# EAGLE design Matching Network V1p1 (EAGLE 9.6.2)
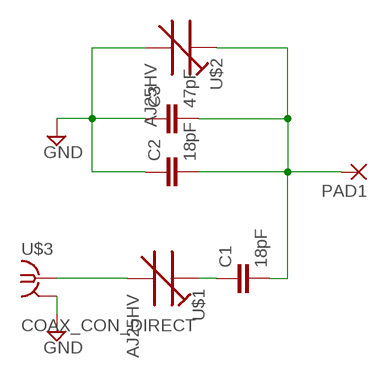
[diagram p0: schematic, sheet 1]

## Parts
C1  18pF  C-EUC1210  [C1210]
C2  18pF  C-EUC1210  [C1210]
C3  47pF  C-EUC1210  [C1210]
PAD1  SMD5  [SMD2,54-5,08]
U$1  AJ25HV  [AJ25HV]
U$2  AJ25HV  [AJ25HV]
U$3  COAX_CON_DIRECT  [COAX.141]

## Nets
GND: C2.1 C3.1 U$2.P$1(A) U$3.P$2(GND)
N$1: C1.1 U$1.P$2(E)
N$2: C1.2 C2.2 C3.2 PAD1.1(P) U$2.P$2(E)
N$3: U$1.P$1(A) U$3.P$1

## Library data of the parts
C1-C3 = rcl:C-EU: CAPACITOR, European symbol; SPICEPREFIX: C
PAD1 = wirepad:SMD5: SMD PAD
U$1 U$2 = Orzada:AJ25HV
U$3 = Orzada:COAX_CON_DIRECT: Direct Coax to Bord Top

## Board
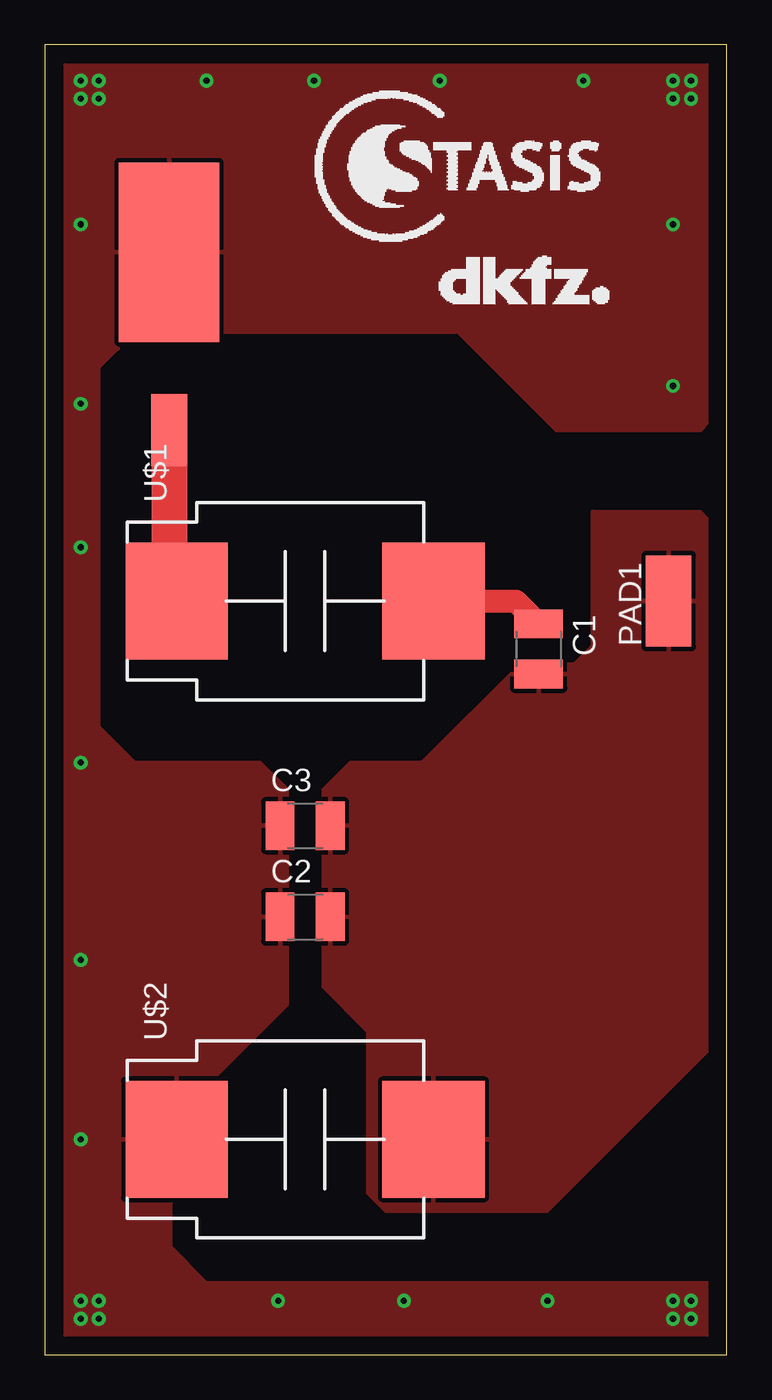
[diagram p1: board, top side]
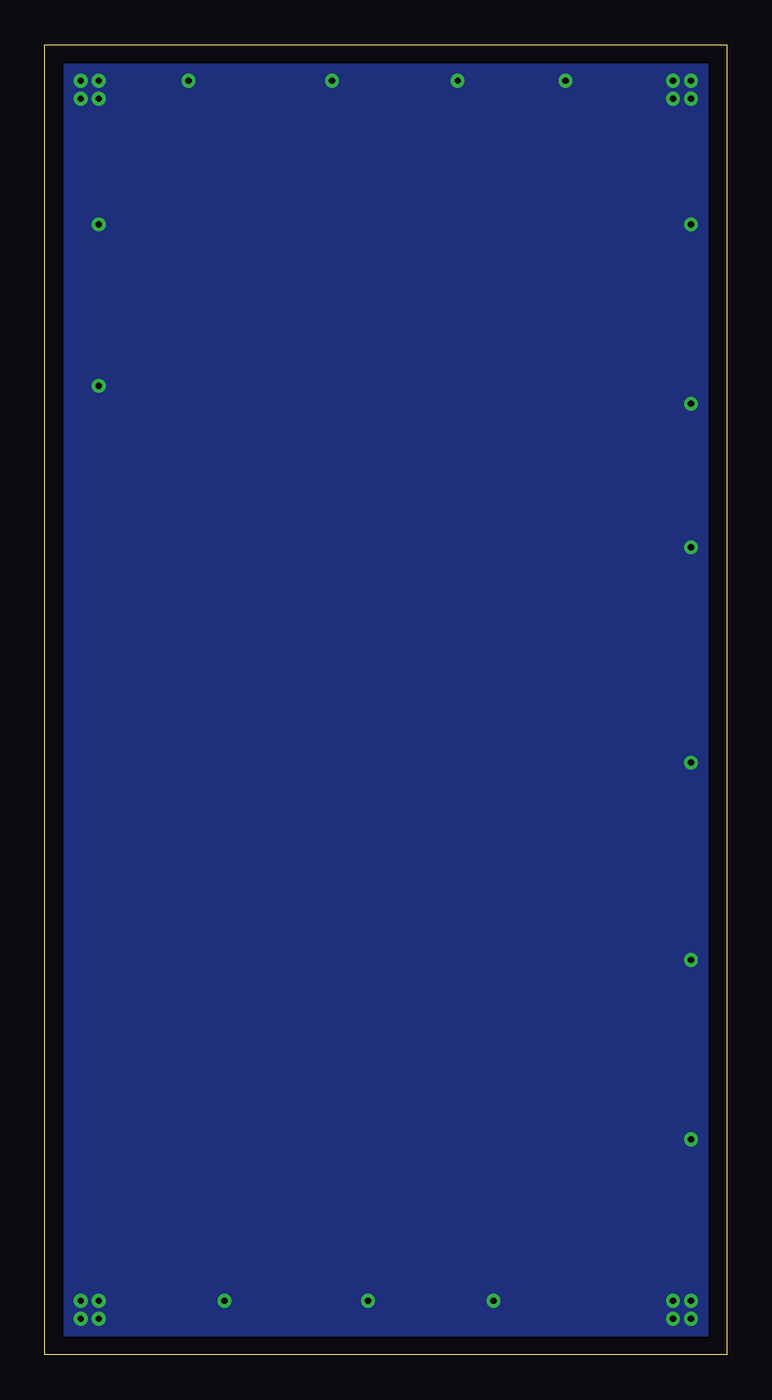
[diagram p2: board, bottom side, seen from below]

Size 38 x 73 mm. Coordinates in mm from the lower left corner, seen from the top.
Outline: 0,0 38,0 38,73 0,73 0,0
Copper layers (1*16): Top 0.035mm / dielectric 0.5mm / Bottom 0.035mm
Design rules "default *": minimum track width 6mil, minimum drill 0.35mm, track to track 6mil, track to pad 6mil, pad to pad 6mil, via to via 6mil, smd to smd 6mil, copper to edge 40mil, drill to drill 6mil, minimum pad ring 10mil, minimum via ring 8mil, stop-mask expansion 4mil, vias tented up to drill 0mil, thermal gap 10mil

### Footprints (pad centres in the part's own frame; a part is rotated, then mirrored left to right if it is on the bottom)
C1210 = smd 1.6 x 2.7: 1 -1.4,0; 2 1.4,0
SMD2,54-5,08 = smd 2.54 x 5.08: 1 0,0
AJ25HV = smd 6.5 x 5.7: P$1 0,7.15; P$2 0,-7.15
COAX.141 = smd 4 x 2: P$1 -3.364,0 | smd 10 x 5.588: P$2 6.546,0

### Placement (x,y rotation side)
C1  27.51,39.33 270 top
C2  14.5,24.4 0 top
C3  14.5,29.48 0 top
PAD1  34.75,42 0 top
U$1  14.5,42 90 top
U$2  14.5,12 90 top
U$3  6.92,54.89 90 top
U$4  [LOGO_STASIS]  24,66 0 top
U$5  [LOGO_DKFZ]  22,58.5 0 top

### Tracks (layer width: path | path; a pad name or v marks a point on that pad's centre or on a via)
GND  (via drill 0.35)
  other vias: 36,71 30,71 22,71 15,71 2,71 9,71 2,63 2,53 2,45 2,33 2,22 2,12 2,2 13,3 20,3 28,3 36,2 35,54 35,63 3,71 2,70 35,71 35,70 36,70 3,70 2,3 3,2 3,3 35,2 35,3 36,3
  pour Bottom: 1,72 37,72 37,1 1,1
  pour Top: 37,52 37,72 1,72 1,1 37,1 37,4 9,4 7,6 7,13 13.5,19.5 13.5,31.5 12,33 5,33 3,35 3,55 5,57 23,57 28.5,51.5 36.5,51.5
N$1
  Top 1.27: U$1.P$2 26.24,42 C1.1
N$2
  pour Top: 37,17 37,46.5 36.5,47 30.5,47 30.5,39.5 29.5,38.5 26.5,38.5 21,33 17,33 15.5,31.5 15.5,20.5 18,18 18,9 19,8 28,8
N$3
  Top 2: U$3.P$1 6.92,42.43 U$1.P$1